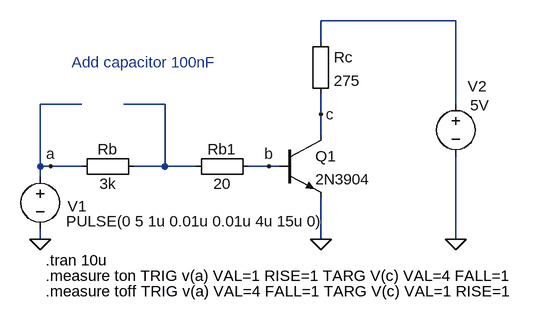
[diagram p0: schematic SWITCH-CAP-1.asc]
SWITCH-CAP-1.asc, the LTspice schematic file:
Version 4
SHEET 1 880 680
WIRE 416 -96 208 -96
WIRE 208 -64 208 -96
WIRE -160 32 -224 32
WIRE -32 32 -96 32
WIRE 416 32 416 -96
WIRE 208 48 208 16
WIRE 208 80 208 48
WIRE -224 128 -224 32
WIRE -208 128 -224 128
WIRE -160 128 -208 128
WIRE -32 128 -32 32
WIRE -32 128 -80 128
WIRE 16 128 -32 128
WIRE 128 128 96 128
WIRE 144 128 128 128
WIRE -224 144 -224 128
WIRE -224 240 -224 224
WIRE 208 240 208 176
WIRE 416 240 416 112
FLAG 208 240 0
FLAG -224 240 0
FLAG 416 240 0
FLAG -208 128 a
FLAG 208 48 c
FLAG 128 128 b
SYMBOL Misc\\EuropeanResistor 192 -80 R0
SYMATTR InstName Rc
SYMATTR Value 275
SYMBOL Misc\\EuropeanResistor -64 112 R90
WINDOW 0 5 56 VBottom 2
WINDOW 3 27 56 VTop 2
SYMATTR InstName Rb
SYMATTR Value 3k
SYMBOL voltage -224 128 R0
WINDOW 3 40 84 Left 2
WINDOW 123 0 0 Left 2
WINDOW 39 0 0 Left 2
WINDOW 0 42 61 Left 2
SYMATTR Value PULSE(0 5 1u 0.01u 0.01u 4u 15u 0)
SYMATTR InstName V1
SYMBOL voltage 416 16 R0
WINDOW 3 22 18 Left 2
WINDOW 123 0 0 Left 2
WINDOW 39 0 0 Left 2
WINDOW 0 18 -11 Left 2
SYMATTR Value 5V
SYMATTR InstName V2
SYMBOL npn 144 80 R0
SYMATTR InstName Q1
SYMATTR Value 2N3904
SYMBOL Misc\\EuropeanResistor 112 112 R90
WINDOW 0 5 56 VBottom 2
WINDOW 3 27 56 VTop 2
SYMATTR InstName Rb1
SYMATTR Value 20
TEXT -216 272 Left 2 !.tran 10u
TEXT -216 320 Left 2 !.measure toff TRIG v(a) VAL=4 FALL=1 TARG V(c) VAL=1 RISE=1
TEXT -216 296 Left 2 !.measure ton TRIG v(a) VAL=1 RISE=1 TARG V(c) VAL=4 FALL=1
TEXT -176 -32 Left 2 ;Add capacitor 100nF

The netlist it stands for:
* SWITCH-CAP-1.asc
Rc N001 c 275
Rb N002 a 3k
V1 a 0 PULSE(0 5 1u 0.01u 0.01u 4u 15u 0)
V2 N001 0 5V
Q1 c b 0 0 2N3904
Rb1 b N002 20
.model NPN NPN
.model PNP PNP
.lib standard.bjt
.tran 10u
.measure toff TRIG v(a) VAL=4 FALL=1 TARG V(c) VAL=1 RISE=1
.measure ton TRIG v(a) VAL=1 RISE=1 TARG V(c) VAL=4 FALL=1
* Add capacitor 100nF
.backanno
.end